# EAGLE design prog_apli_adap (EAGLE 5.04)
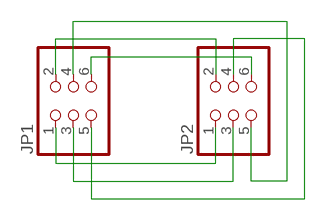
[diagram p0: schematic, sheet 1]

## Parts
JP1  PINHD-2X3  [2X03]
JP2  PINHD-2X3  [2X03]

## Nets
N$1: JP1.1 JP2.1
N$2: JP1.2 JP2.2
N$3: JP1.3 JP2.3
N$4: JP1.4 JP2.5
N$5: JP1.5 JP2.4
N$6: JP1.6 JP2.6

## Library data of the parts
JP1 JP2 = pinhead:PINHD-2X3: PIN HEADER

## Board
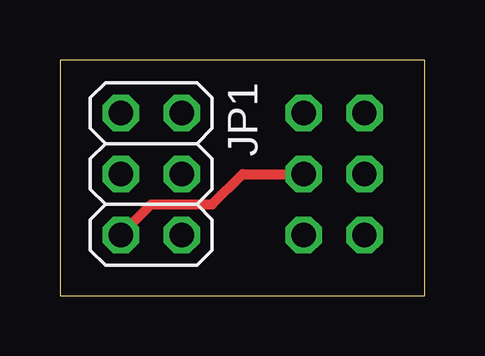
[diagram p1: board, top side]
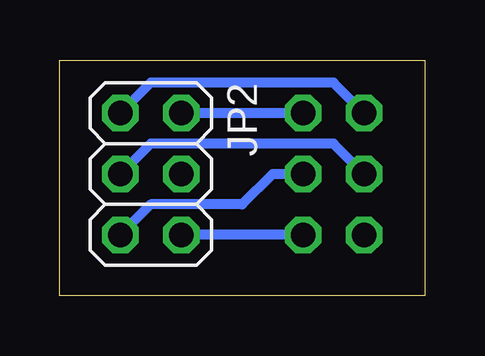
[diagram p2: board, bottom side, seen from below]

Size 15.22 x 9.83 mm. Coordinates in mm from the lower left corner, seen from the top.
Outline: 0,0 15.22,0 15.22,9.83 0,9.83 0,0
Copper layers (1*16): Top 0.035mm / dielectric 1.5mm / Bottom 0.035mm
Design rules "default": minimum track width 10mil, minimum drill 24mil, track to track 8mil, track to pad 8mil, pad to pad 8mil, via to via 8mil, smd to smd 8mil, copper to edge 40mil, drill to drill 8mil, minimum pad ring 10mil, minimum via ring 8mil, stop-mask expansion 4mil, vias tented up to drill 0mil, thermal gap 10mil

### Footprints (pad centres in the part's own frame; a part is rotated, then mirrored left to right if it is on the bottom)
2X03 = drill 1.016 octagon: 1 -2.54,-1.27; 2 -2.54,1.27; 3 0,-1.27; 4 0,1.27; 5 2.54,-1.27; 6 2.54,1.27

### Placement (x,y rotation side)
JP1  3.81,5.08 270 top
JP2  11.43,5.08 270 bottom

### Tracks (layer width: path | path; a pad name or v marks a point on that pad's centre or on a via)
N$1
  Bottom 0.406: JP1.1 3.81,8.89 11.43,8.89 JP2.1
N$2
  Bottom 0.406: JP1.2 JP2.2
N$3
  Bottom 0.406: JP1.3 3.81,6.35 11.43,6.35 JP2.3
N$4
  Bottom 0.406: JP1.4 6.35,5.08 7.62,3.81 11.43,3.81 JP2.5
N$5
  Top 0.406: JP1.5 3.81,3.81 6.35,3.81 7.62,5.08 JP2.4
N$6
  Bottom 0.406: JP1.6 JP2.6